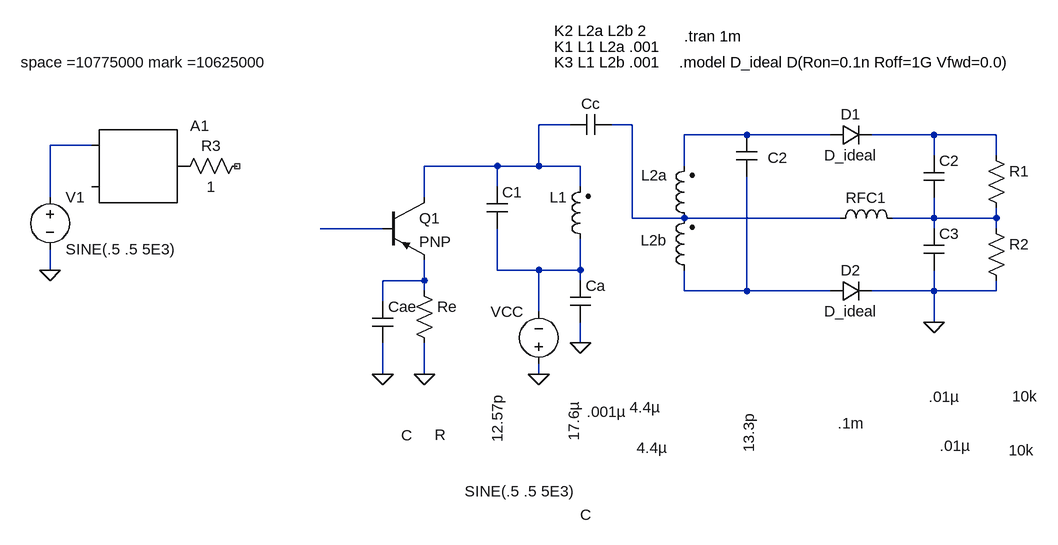
[diagram p0: schematic Foster-Seeley-circuito.asc]
Foster-Seeley-circuito.asc, the LTspice schematic file:
Version 4
SHEET 1 880 680
WIRE 64 32 16 32
WIRE 160 32 128 32
WIRE 336 48 240 48
WIRE 464 48 336 48
WIRE 624 48 528 48
WIRE 720 48 624 48
WIRE -672 64 -736 64
WIRE 624 80 624 48
WIRE 720 80 720 48
WIRE -48 96 -160 96
WIRE 16 96 16 32
WIRE 16 96 -48 96
WIRE 80 96 16 96
WIRE 240 96 240 48
WIRE -48 128 -48 96
WIRE 80 128 80 96
WIRE -736 144 -736 64
WIRE -160 144 -160 96
WIRE 160 176 160 32
WIRE 240 176 160 176
WIRE 480 176 240 176
WIRE 624 176 624 144
WIRE 624 176 560 176
WIRE 720 176 720 160
WIRE 720 176 624 176
WIRE -224 192 -320 192
WIRE 624 192 624 176
WIRE 720 192 720 176
WIRE -736 256 -736 224
WIRE -48 256 -48 192
WIRE 16 256 -48 256
WIRE 80 256 80 208
WIRE 80 256 16 256
WIRE -160 272 -160 240
WIRE -160 272 -224 272
WIRE 80 272 80 256
WIRE -160 288 -160 272
WIRE 240 288 240 256
WIRE 336 288 336 112
WIRE 336 288 240 288
WIRE 464 288 336 288
WIRE 624 288 624 256
WIRE 624 288 528 288
WIRE 720 288 720 272
WIRE 720 288 624 288
WIRE -224 304 -224 272
WIRE 16 320 16 256
WIRE 624 336 624 288
WIRE 80 368 80 336
WIRE -224 416 -224 368
WIRE -160 416 -160 368
WIRE 16 416 16 400
FLAG 624 336 0
FLAG -736 256 0
FLAG -160 416 0
FLAG -224 416 0
FLAG 16 416 0
FLAG 80 368 0
SYMBOL ind2 96 224 R180
WINDOW 0 36 80 Left 2
WINDOW 3 26 -295 VRight 2
SYMATTR InstName L1
SYMATTR Value 17.6µ
SYMATTR Type ind
SYMBOL ind2 256 192 R180
WINDOW 0 43 -18 Left 2
WINDOW 3 53 -275 Left 2
SYMATTR InstName L2b
SYMATTR Value 4.4µ
SYMATTR Type ind
SYMBOL cap -64 128 R0
WINDOW 3 16 319 VRight 2
SYMATTR Value 12.57p
SYMATTR InstName C1
SYMBOL res 704 64 R0
WINDOW 3 40 386 Left 2
SYMATTR InstName R1
SYMATTR Value 10k
SYMBOL cap 608 80 R0
WINDOW 3 8 371 Left 2
SYMATTR InstName C2
SYMATTR Value .01µ
SYMBOL diode 464 64 R270
WINDOW 0 32 32 VTop 2
WINDOW 3 0 32 VBottom 2
SYMATTR InstName D1
SYMATTR Value D_ideal
SYMBOL diode 464 304 R270
WINDOW 0 32 32 VTop 2
WINDOW 3 0 32 VBottom 2
SYMATTR InstName D2
SYMATTR Value D_ideal
SYMBOL cap 608 192 R0
WINDOW 3 25 334 Left 2
SYMATTR InstName C3
SYMATTR Value .01µ
SYMBOL cap 320 48 R0
WINDOW 0 48 35 Left 2
WINDOW 3 19 428 VRight 2
SYMATTR InstName C2
SYMATTR Value 13.3p
SYMBOL res 704 176 R0
WINDOW 3 35 357 Left 2
SYMATTR InstName R2
SYMATTR Value 10k
SYMBOL ind 464 192 R270
WINDOW 0 32 56 VTop 2
WINDOW 3 -284 32 VBottom 2
SYMATTR InstName RFC1
SYMATTR Value .1m
SYMBOL res -432 80 R90
WINDOW 0 0 56 VBottom 2
WINDOW 3 32 56 VTop 2
SYMATTR InstName R3
SYMATTR Value 1
SYMBOL cap 64 48 R270
WINDOW 0 32 32 VTop 2
WINDOW 3 -410 56 VBottom 2
SYMATTR InstName Cc
SYMATTR Value .001µ
SYMBOL ind2 256 272 R180
WINDOW 0 42 162 Left 2
WINDOW 3 42 -257 Left 2
SYMATTR InstName L2a
SYMATTR Value 4.4µ
SYMATTR Type ind
SYMBOL SpecialFunctions/modulate -672 64 R0
WINDOW 3 -109 -128 Left 2
SYMATTR Value space =10775000 mark =10625000
SYMATTR InstName A1
SYMBOL voltage -736 128 R0
SYMATTR InstName V1
SYMATTR Value SINE(.5 .5 5E3)
SYMBOL pnp -224 144 R0
SYMATTR InstName Q1
SYMBOL res -176 272 R0
WINDOW 3 32 237 Left 2
SYMATTR InstName Re
SYMBOL cap -240 304 R0
WINDOW 3 44 206 Left 2
SYMATTR InstName Cae
SYMBOL voltage 16 416 R180
WINDOW 0 24 96 Left 2
WINDOW 3 -55 -180 Left 2
SYMATTR InstName VCC
SYMATTR Value SINE(.5 .5 5E3)
SYMBOL cap 64 272 R0
WINDOW 3 16 360 Left 2
SYMATTR InstName Ca
TEXT 232 -64 Left 2 !.model D_ideal D(Ron=0.1n Roff=1G Vfwd=0.0)
TEXT 40 -88 Left 2 !K1 L1 L2a .001
TEXT 40 -112 Left 2 !K2 L2a L2b 2
TEXT 40 -64 Left 2 !K3 L1 L2b .001
TEXT 240 -104 Left 2 !.tran 1m

The netlist it stands for:
* Foster-Seeley-circuito.asc
L1 N008 N001 17.6µ
L2b N002 N003 4.4µ
C1 N001 N008 12.57p
R1 N004 N006 10k
C2 N004 N006 .01µ
D1 N003 N004 D_ideal
D2 N010 0 D_ideal
C3 N006 0 .01µ
C2 N003 N010 13.3p
R2 N006 0 10k
L§RFC1 N002 N006 .1m
R3 NC_01 P001 1
Cc N001 N002 .001µ
L2a N010 N002 4.4µ
A1 N005 0 0 0 0 0 P001 0 MODULATOR space =10775000 mark =10625000
V1 N005 0 SINE(.5 .5 5E3)
Q1 N001 N007 N009 0 PNP
Re N009 0 R
Cae N009 0 C
VCC 0 N008 SINE(.5 .5 5E3)
Ca N008 0 C
.model D D
.lib standard.dio
.model NPN NPN
.model PNP PNP
.lib standard.bjt
.model D_ideal D(Ron=0.1n Roff=1G Vfwd=0.0)
K1 L1 L2a .001
K2 L2a L2b 2
K3 L1 L2b .001
.tran 1m
.backanno
.end